# EAGLE design Adafruit Proto Shield v7-power (EAGLE 9.1.3)
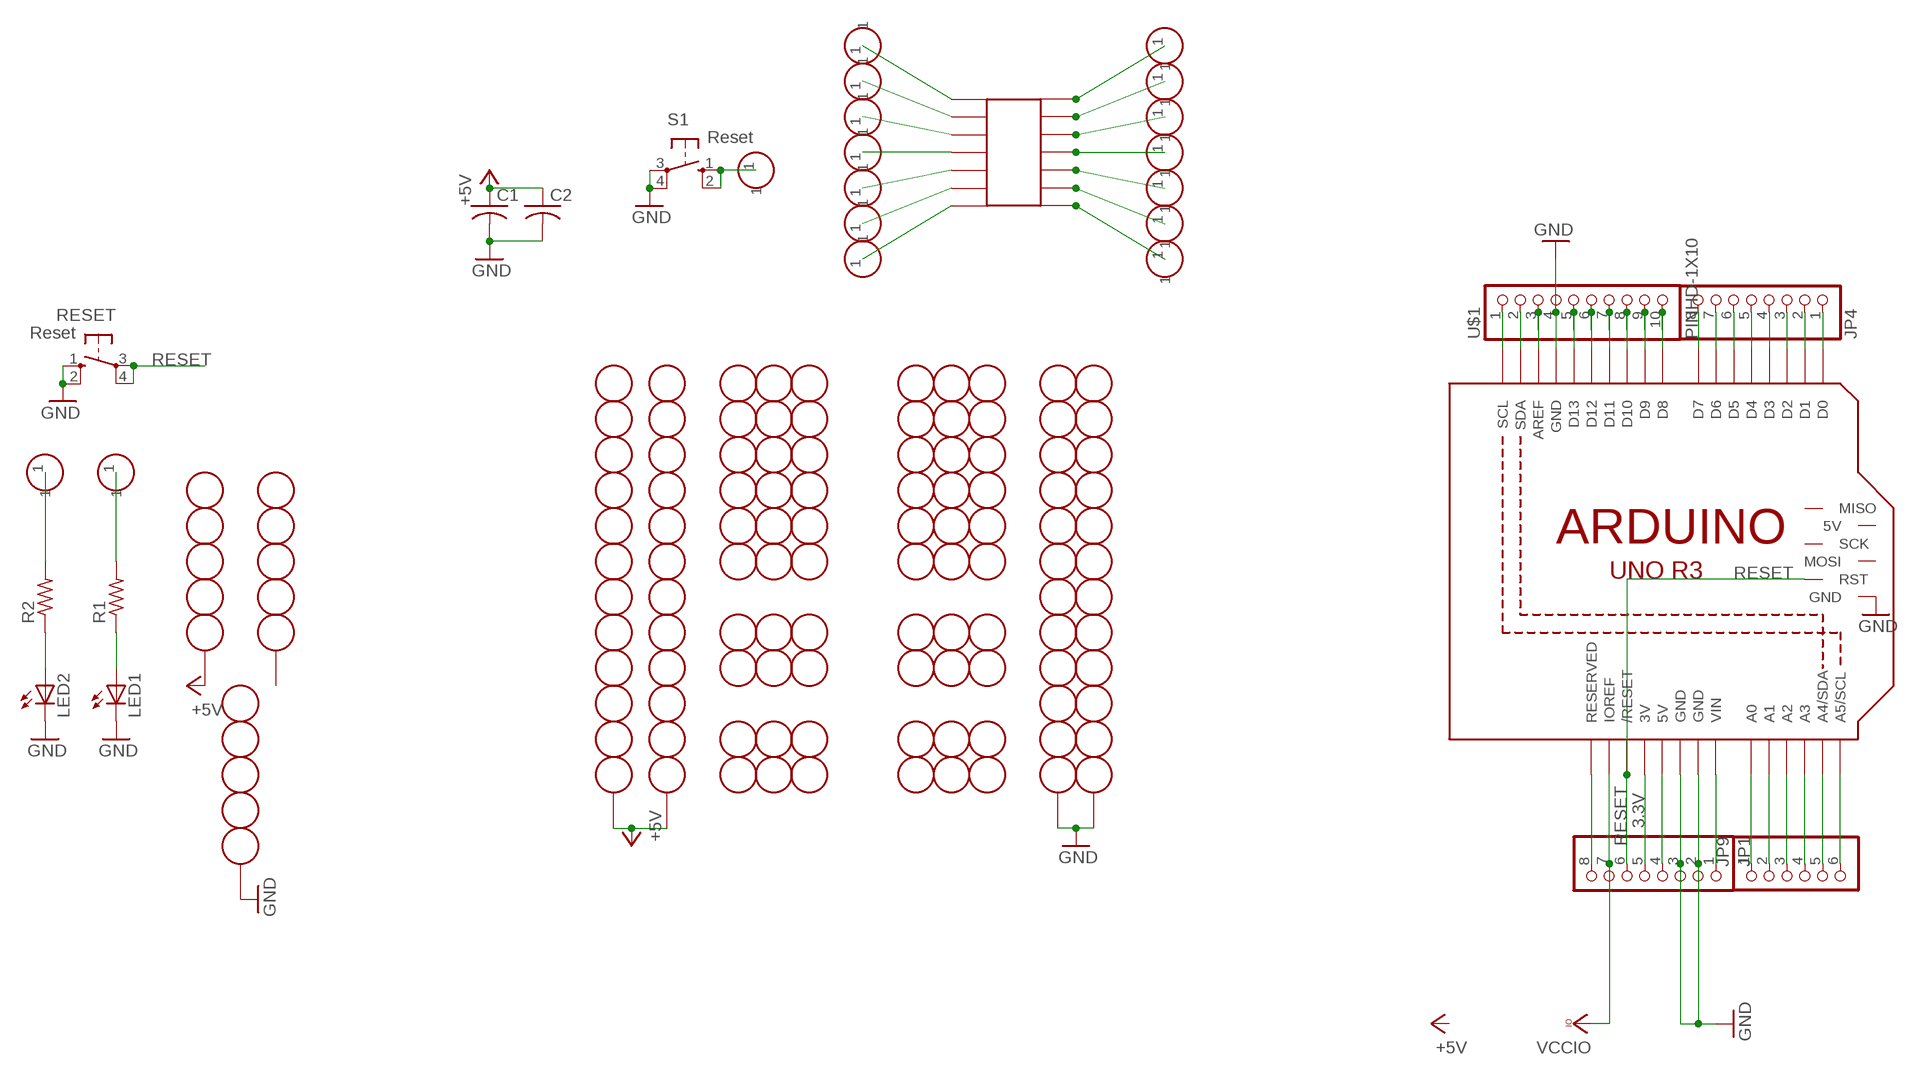
[diagram p0: schematic, sheet 1]

## Parts
C1  C-US025-025X050  [C025-025X050]
C2  C-US025-025X050  [C025-025X050]
GNDSTRIP1  12-STRIP  [12-STRIP]
GNDSTRIP2  12-STRIP  [12-STRIP]
IC1  SMD-14  [SO-14NMW]
JP1  PINHD-1X8BIG  [1X08-BIG]
JP4  PINHD-1X8BIG  [1X08-BIG]
JP9  PINHD-1X6B  [1X06-BIG]
LED1  LED3MM  [LED3MM]
LED2  LED3MM  [LED3MM]
M1  ARDUINO_R3_ICSP  [ARDUINOR3_ICSP]
R1  R-US_0207/5V  [0207/5V]
R2  R-US_0207/5V  [0207/5V]
RESET  Reset  10-XX  [B3F-10XX]
S1  Reset  10-XX  [B3F-10XX]
U$1  PINHD-1X10  [1X10-BIG]
U$2  PERFHOLE  [PERFHOLE]
U$3  5-STRIP  [5-STRIP]
U$4  PERFHOLE  [PERFHOLE]
U$5  3-STRIP  [3-STRIP]
U$6  PERFHOLE  [PERFHOLE]
U$7  PERFHOLE  [PERFHOLE]
U$8  PERFHOLE  [PERFHOLE]
U$9  PERFHOLE  [PERFHOLE]
U$10  3-STRIP  [3-STRIP]
U$11  3-STRIP  [3-STRIP]
U$12  3-STRIP  [3-STRIP]
U$13  3-STRIP  [3-STRIP]
U$14  3-STRIP  [3-STRIP]
U$15  3-STRIP  [3-STRIP]
U$16  PERFHOLE  [PERFHOLE]
U$17  3-STRIP  [3-STRIP]
U$18  3-STRIP  [3-STRIP]
U$19  PERFHOLE  [PERFHOLE]
U$20  3-STRIP  [3-STRIP]
U$21  3-STRIP  [3-STRIP]
U$22  3-STRIP  [3-STRIP]
U$23  3-STRIP  [3-STRIP]
U$24  5-STRIP  [5-STRIP]
U$25  PERFHOLE  [PERFHOLE]
U$26  3-STRIP  [3-STRIP]
U$27  PERFHOLE  [PERFHOLE]
U$28  3-STRIP  [3-STRIP]
U$29  3-STRIP  [3-STRIP]
U$30  3-STRIP  [3-STRIP]
U$31  3-STRIP  [3-STRIP]
U$32  3-STRIP  [3-STRIP]
U$33  3-STRIP  [3-STRIP]
U$34  PERFHOLE  [PERFHOLE]
U$35  PERFHOLE  [PERFHOLE]
U$37  PERFHOLE  [PERFHOLE]
U$38  PERFHOLE  [PERFHOLE]
U$39  PERFHOLE  [PERFHOLE]
U$40  PERFHOLE  [PERFHOLE]
U$41  PERFHOLE  [PERFHOLE]
U$43  5-STRIP  [5-STRIP]
VCCSTRIP1  12-STRIP  [12-STRIP]
VCCSTRIP2  12-STRIP  [12-STRIP]

## Nets
3.3V: JP1.5 M1.3V
+5V: C1.1 C2.1 JP1.4 M1.5V U$24.P$3 VCCSTRIP1.P$1 VCCSTRIP2.P$1
GND: C1.2 C2.2 GNDSTRIP1.P$1 GNDSTRIP2.P$1 JP1.2 JP1.3 LED1.K(C) LED2.K(C) M1.GND M1.GND@1(GND) M1.GND@2(GND) M1.GND@3(GND) RESET.1(S) RESET.2(S1) S1.3(P) S1.4(P1) U$1.4 U$43.P$3
N$2: M1.AREF U$1.3
N$4: JP1.8 M1.RESERVED
N$5: M1.D13 U$1.5
N$8: LED1.A R1.1
N$16: R1.2 U$7.1
N$40: R2.2 U$4.1
N$41: LED2.A R2.1
N$45: M1.D12 U$1.6
N$54: M1.D11 U$1.7
N$55: M1.D10 U$1.8
N$56: M1.D9 U$1.9
N$57: M1.D8 U$1.10
N$58: JP9.1 M1.A0
N$59: JP9.2 M1.A1
N$70: JP9.3 M1.A2
N$88: JP9.4 M1.A3
N$89: JP9.5 M1.A4(A4/SDA)
N$92: JP9.6 M1.A5(A5/SCL)
N$93: JP4.1 M1.D0
N$94: JP4.2 M1.D1
N$115: JP4.3 M1.D2
N$116: JP4.4 M1.D3
N$117: JP4.5 M1.D4
N$126: IC1.P$1 U$2.1
N$127: IC1.P$2 U$6.1
N$135: JP4.6 M1.D5
N$145: JP4.7 M1.D6
N$149: IC1.P$3 U$8.1
N$150: IC1.P$4 U$9.1
N$151: IC1.P$5 U$19.1
N$152: JP4.8 M1.D7
N$153: JP1.1 M1.VIN
N$154: M1.SCL U$1.1
N$155: IC1.P$6 U$25.1
N$156: IC1.P$7 U$27.1
N$157: IC1.P$8 U$34.1
N$158: IC1.P$9 U$35.1
N$159: IC1.P$10 U$37.1
N$164: M1.SDA U$1.2
N$165: IC1.P$11 U$38.1
N$166: IC1.P$12 U$39.1
N$167: IC1.P$13 U$40.1
N$178: IC1.P$14 U$41.1
N$194: S1.1(S) S1.2(S1) U$16.1
RESET: JP1.6 M1.RESET(/RESET) M1.RESET_ICSP(RST) RESET.3(P) RESET.4(P1)
VCCIO: JP1.7 M1.IOREF
Unconnected: M1.5V_ICSP(5V) M1.MISO M1.MOSI M1.SCK U$3.P$3

## Library data of the parts
C1 C2 = rcl-ez:C-US: CAPACITOR, American symbol
GNDSTRIP1 GNDSTRIP2 VCCSTRIP1 VCCSTRIP2 = Atmex:12-STRIP
IC1 = carduino:SMD-14
JP1 JP4 = carduino:PINHD-1X8: PIN HEADER
JP9 = carduino:PINHD-1X6: PIN HEADER
LED1 LED2 = adafruit:LED: LED OSRAM: - CHIPLED LG R971, LG N971, LY N971, LG Q971, LY Q971, LO R971, LY R971 LH N974, LH R974 LS Q976, LO Q976, LY Q976 LO Q996 - Hyper CHIPLED LW Q18S LB Q993, LB Q99A, LB R99A - SideLED LS A670, LO A670, LY A670, LG A670, LP A670 LB A673, LV A673, LT A673, LW A673 LH A674 LY A675 LS A676, LA A676, LO A676, LY A676, LW A676 LS A679, LY A679, LG A679 - Hyper Micro SIDELED® LS Y876, LA Y876, LO Y876, LY Y876 LT Y87S - SmartLED LW L88C, LW L88S LB L89C, LB L89S, LG L890 LS L89K, LO L89K, LY L89K LS L896, LA L896, LO L896, LY L896 - TOPLED LS T670, LO T670, LY T670, LG T670, LP T670 LSG T670, LSP T670, LSY T670, LOP T670, LYG T670 LG T671, LOG T671, LSG T671 LB T673, LV T673, LT T673, LW T673 LH T674 LS T676, LA T676, LO T676, LY T676, LB T676, LH T676, LSB T676, LW T676 LB T67C, LV T67C, LT T67C, LS T67K, LO T67K, LY T67K, LW E67C LS E67B, LA E67B, LO E67B, LY E67B, LB E67C, LV E67C, LT E67C LW T67C LS T679, LY T679, LG T679 LS T770, LO T770, LY T770, LG T770, LP T770 LB T773, LV T773, LT T773, LW T773 LH T774 LS E675, LA E675, LY E675, LS T675 LS T776, LA T776, LO T776, LY T776, LB T776 LHGB T686 LT T68C, LB T68C - Hyper Mini TOPLED® LB M676 - Mini TOPLED Santana® LG M470 LS M47K, LO M47K, LY M47K Source: http://www.osram.convergy.de/
M1 = adafruit:ARDUINO_R3_ICSP
R1 R2 = rcl-ez:R-US_: RESISTOR, American symbol
RESET S1 = switch-omron:10-XX: OMRON SWITCH
U$1 = adafruit:PINHD-1X10: Pin header 1x10 0.1" spacing With round pins
U$2 U$4 U$6-U$9 U$16 U$19 U$25 U$27 U$34 U$35 U$37-U$41 = Atmex:PERFHOLE
U$3 = protoshield:5-STRIP
U$5 U$10-U$15 U$17 U$18 U$20-U$23 U$26 U$28-U$33 = Atmex:3-STRIP
U$24 U$43 = Atmex:5-STRIP

## Board
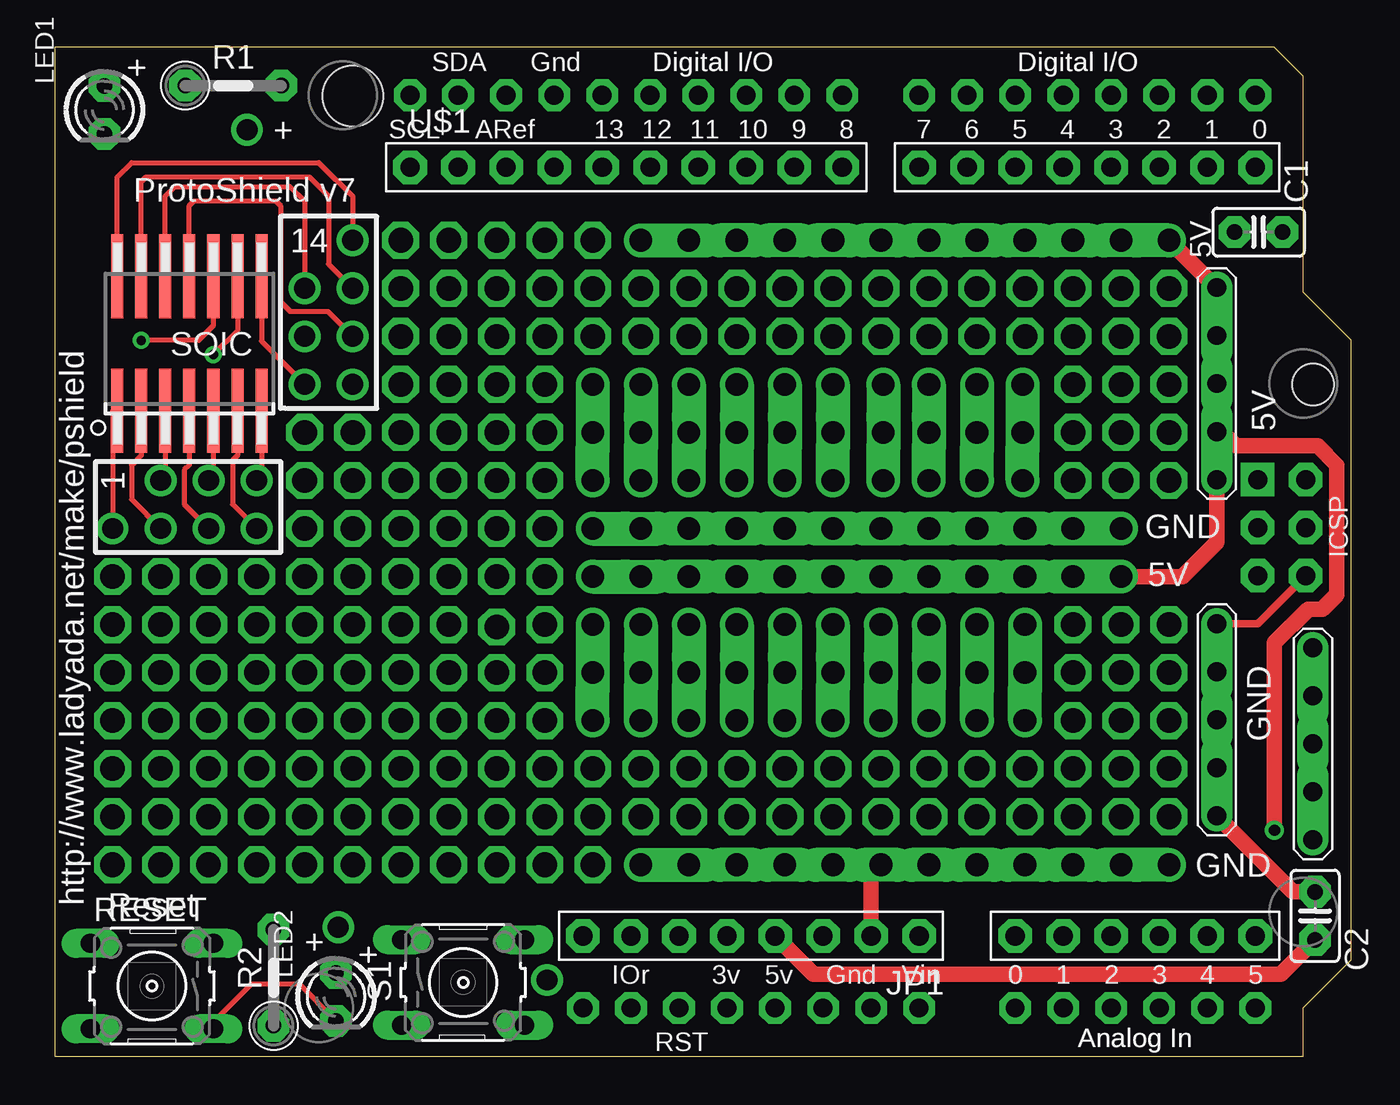
[diagram p1: board, top side]
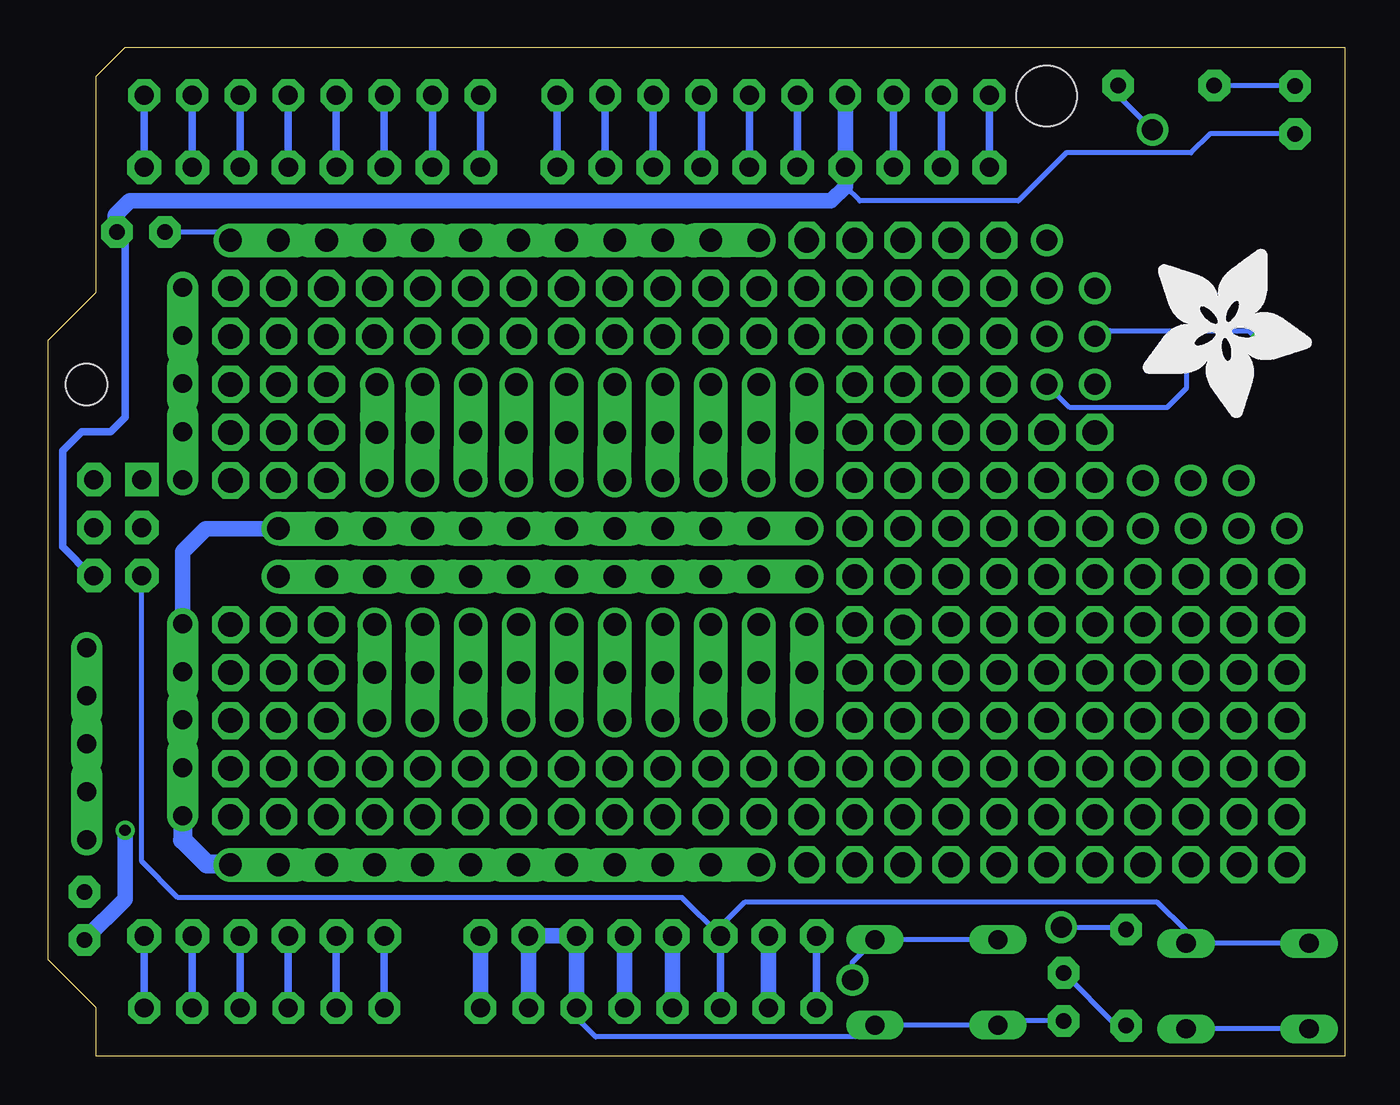
[diagram p2: board, bottom side, seen from below]

Size 68.58 x 53.34 mm. Coordinates in mm from the lower left corner, seen from the top.
Copper layers (1*16): Top 0.035mm / dielectric 1.5mm / Bottom 0.035mm
Design rules "adafruit": minimum track width 8mil, minimum drill 15.5mil, track to track 8mil, track to pad 8mil, pad to pad 8mil, via to via 8mil, smd to smd 8mil, copper to edge 10mil, drill to drill 8mil, minimum pad ring 10mil, minimum via ring 8mil, stop-mask expansion 2mil, vias tented up to drill 20mil, thermal gap 10mil
Holes 3.2 mm at 15.76,50.75
Holes 2.2 mm at 66.56,35.51

### Footprints (pad centres in the part's own frame; a part is rotated, then mirrored left to right if it is on the bottom)
C025-025X050 = drill 0.813 pad 1.676 octagon: 1 -1.27,0; 2 1.27,0
12-STRIP = drill 1.2 pad 1.676 offset: P$1 0,0; P$11 27.94,0 | drill 1.2 pad 1.676 long: P$2 2.54,0; P$3 5.08,0; P$4 7.62,0; P$5 10.16,0; P$6 12.7,0; P$7 15.24,0; P$8 17.78,0; P$9 20.32,0; P$10 22.86,0; P$12 25.4,0
SO-14NMW = smd 0.635 x 4.445: P$1 -3.048,-3.683; P$2 -1.778,-3.683; P$3 -0.508,-3.683; P$4 0.762,-3.683; P$5 2.032,-3.683; P$6 3.302,-3.683; P$7 4.572,-3.683; P$8 4.572,3.429; P$9 3.302,3.429; P$10 2.032,3.429; P$11 0.762,3.429; P$12 -0.508,3.429; P$13 -1.778,3.429; P$14 -3.048,3.429
1X08-BIG = drill 1.016 pad 1.778 octagon: 1 -8.89,0; 2 -6.35,0; 3 -3.81,0; 4 -1.27,0; 5 1.27,0; 6 3.81,0; 7 6.35,0; 8 8.89,0
1X06-BIG = drill 1.016 pad 1.778 octagon: 1 -6.35,0; 2 -3.81,0; 3 -1.27,0; 4 1.27,0; 5 3.81,0; 6 6.35,0
LED3MM = drill 0.813 pad 1.676 octagon: A -1.27,0; K 1.27,0
ARDUINOR3_ICSP = drill 1 pad 1.676 octagon: 3V 35.56,2.54; 5V 38.1,2.54; A0 50.8,2.54; A1 53.34,2.54; A2 55.88,2.54; A3 58.42,2.54; A4 60.96,2.54; A5 63.5,2.54; AREF 23.876,50.8; D0 63.5,50.8; D1 60.96,50.8; D2 58.42,50.8; D3 55.88,50.8; D4 53.34,50.8; D5 50.8,50.8; D6 48.26,50.8; D7 45.72,50.8; D8 41.656,50.8; D9 39.116,50.8; D10 36.576,50.8; D11 34.036,50.8; D12 31.496,50.8; D13 28.956,50.8; GND 26.416,50.8; GND@1 43.18,2.54; GND@2 40.64,2.54; IOREF 30.48,2.54; RESERVED 27.94,2.54; RESET 33.02,2.54; SCL 18.796,50.8; SDA 21.336,50.8; VIN 45.72,2.54 | drill 1 pad 1.778 octagon: 5V_ICSP 66.167,30.48; GND@3 66.167,25.4; MOSI 66.167,27.94; RESET_ICSP 63.627,25.4; SCK 63.627,27.94 | drill 1 pad 1.778 square: MISO 63.627,30.48
0207/5V = drill 0.813 pad 1.676 octagon: 1 -2.54,0; 2 2.54,0
B3F-10XX = drill 1.016 long: 1 -3.251,2.261; 2 3.251,2.261; 3 -3.251,-2.261; 4 3.251,-2.261
1X10-BIG = drill 1.016 pad 1.778 octagon: 1 -11.43,0; 2 -8.89,0; 3 -6.35,0; 4 -3.81,0; 5 -1.27,0; 6 1.27,0; 7 3.81,0; 8 6.35,0; 9 8.89,0; 10 11.43,0
PERFHOLE = drill 1.1 pad 1.676: 1 0,0
5-STRIP = drill 1 pad 1.676 long: P$1 2.54,0; P$2 5.08,0; P$5 7.62,0 | drill 1 pad 1.676 offset: P$3 0,0; P$4 10.16,0
3-STRIP = drill 1.2 pad 1.676 offset: 1 -2.54,0; P$5 2.54,0 | drill 1.2 pad 1.676 long: P$6 0,0

### Placement (x,y rotation side)
C1  63.67,43.57 0 top
C2  66.66,7.41 90 top
GNDSTRIP1  56.4,27.89 180 top
GNDSTRIP2  58.94,10.11 180 top
IC1  6.36,37.8 0 top
JP1  36.83,6.35 180 top
JP4  54.61,46.99 180 top
JP9  57.15,6.35 0 top
LED1  2.62,50.03 270 top
LED2  14.87,3.13 270 top
M1  0,0 0 top
R1  9.44,51.32 0 top
R2  11.57,4.15 90 top
RESET  5.14,3.7 180 top
S1  21.6,3.89 0 top
U$1  30.23,46.99 0 top
U$2  3.06,27.89 0 top
U$3  66.55,11.43 90 top
U$4  15,6.81 0 top
U$5  48.78,20.27 90 top
U$6  5.6,27.89 0 top
U$7  10.17,48.98 0 top
U$8  5.6,30.43 0 top
U$9  8.14,27.89 0 top
U$10  46.24,32.97 90 top
U$11  46.24,20.27 90 top
U$12  48.78,32.97 90 top
U$13  51.19,32.97 90 top
U$14  51.32,20.27 90 top
U$15  43.83,32.97 90 top
U$16  26.05,4.02 0 top
U$17  28.46,32.97 90 top
U$18  31,20.27 90 top
U$19  8.14,30.43 0 top
U$20  33.54,32.97 90 top
U$21  38.62,32.97 90 top
U$22  36.08,20.27 90 top
U$23  38.62,20.27 90 top
U$24  61.47,30.48 90 top
U$25  10.68,27.89 0 top
U$26  28.46,20.27 90 top
U$27  10.68,30.43 0 top
U$28  41.16,32.97 90 top
U$29  31,32.97 90 top
U$30  36.08,32.97 90 top
U$31  33.54,20.27 90 top
U$32  43.7,20.27 90 top
U$33  41.16,20.27 90 top
U$34  13.22,35.51 90 top
U$35  15.76,35.51 90 top
U$36  [ADAFRUIT_9MM]  10.67,42.67 270 bottom
U$37  13.22,38.05 90 top
U$38  15.76,38.05 90 top
U$39  13.22,40.59 90 top
U$40  15.76,40.59 90 top
U$41  15.76,43.13 90 top
U$43  61.47,12.7 90 top
VCCSTRIP1  58.94,43.13 180 top
VCCSTRIP2  56.4,25.35 180 top

### Tracks (layer width: path | path; a pad name or v marks a point on that pad's centre or on a via)
3.3V
  Bottom 0.813: JP1.5 M1.3V
+5V  (via drill 0.6)
  Top 0.813: VCCSTRIP2.P$1 59.64,25.35 61.47,27.18 U$24.P$3 61.47,33.27 | VCCSTRIP1.P$1 61.47,40.6 61.47,33.27 | JP1.4 40.13,4.32 64.84,4.32 C2.1 | 61.47,33.27 62.48,32.26 66.8,32.26 67.82,31.24 67.82,24.38 67.06,23.62 66.29,23.62 64.52,21.84 v64.52,11.94
  Bottom 0.254: VCCSTRIP1.P$1 59.38,43.57 C1.1
  Bottom 0.406: 61.47,30.73 U$24.P$3
  Bottom 0.813: JP1.4 M1.5V | v64.52,11.94 64.52,8.29 C2.1
GND
  Top 0.254: RESET.1 8.39,1.79 10.41,3.81 12.92,3.81 LED2.K
  Top 0.406: M1.GND@3 63.63,22.86 61.98,22.86 61.47,22.35 U$43.P$3
  Top 0.813: JP1.2 43.18,9.91 43.39,10.11 GNDSTRIP2.P$1 | C2.2 65.49,8.68 U$43.P$3
  Bottom 0.254: LED2.K 18.12,1.86 S1.3 S1.4 25.47,1.02 39.62,1.02 40.64,2.03 M1.GND@2 | RESET.2 RESET.1 | LED1.K 7.12,48.76 8.13,47.75 14.73,47.75 17.27,45.21 25.65,45.21 26.42,45.97
  Bottom 0.406: C1.2 64.52,43.14 64.52,33.78 65.28,33.02 66.8,33.02 67.82,32 67.82,26.92 66.29,25.4 M1.GND@3
  Bottom 0.813: M1.GND U$1.4 26.42,45.97 27.18,45.21 64.26,45.21 65.02,44.45 65.02,43.65 C1.2 | M1.GND@2 JP1.3 JP1.2 M1.GND@1 | GNDSTRIP1.P$1 60.24,27.89 61.47,26.67 U$43.P$3
  Bottom 1.016: U$43.P$3 61.47,11.43 60.2,10.16 58.98,10.16 GNDSTRIP2.P$1
N$1  (via drill 1.3 pad 1.93)
  other vias: 58.94,30.43
N$2
  Bottom 0.406: U$1.3 M1.AREF
N$3  (via drill 1.3 pad 1.93)
  other vias: 13.22,32.97
N$4
  Bottom 0.406: JP1.8 M1.RESERVED
N$5
  Bottom 0.406: M1.D13 U$1.5
N$6  (via drill 1.3 pad 1.93)
  other vias: 13.22,30.43
N$7  (via drill 1.3 pad 1.93)
  other vias: 13.22,27.89
N$8
  Bottom 0.254: LED1.A 6.88,51.3 R1.1
N$9  (via drill 1.3 pad 1.93)
  other vias: 3.06,25.35
N$10  (via drill 1.3 pad 1.93)
  other vias: 3.06,22.81
N$11  (via drill 1.3 pad 1.93)
  other vias: 36.08,12.65
N$12  (via drill 1.3 pad 1.93)
  other vias: 36.08,15.19
N$13  (via drill 1.3 pad 1.93)
  other vias: 36.08,38.05
N$14  (via drill 1.3 pad 1.93)
  other vias: 36.08,40.59
N$16
  Bottom 0.254: R1.2 11.98,50.79 U$7.1
N$17  (via drill 1.3 pad 1.93)
  other vias: 8.14,25.35
N$18  (via drill 1.3 pad 1.93)
  other vias: 8.14,22.81
N$19  (via drill 1.3 pad 1.93)
  other vias: 8.14,20.27
N$20  (via drill 1.3 pad 1.93)
  other vias: 25.92,10.11
N$21  (via drill 1.3 pad 1.93)
  other vias: 23.38,10.11
N$22  (via drill 1.3 pad 1.93)
  other vias: 28.46,10.11
N$23  (via drill 1.3 pad 1.93)
  other vias: 8.14,10.11
N$24  (via drill 1.3 pad 1.93)
  other vias: 10.68,10.11
N$25  (via drill 1.3 pad 1.93)
  other vias: 23.38,30.43
N$26  (via drill 1.3 pad 1.93)
  other vias: 23.38,32.97
N$27  (via drill 1.3 pad 1.93)
  other vias: 23.38,35.51
N$28  (via drill 1.3 pad 1.93)
  other vias: 25.92,30.43
N$29  (via drill 1.3 pad 1.93)
  other vias: 25.92,32.97
N$30  (via drill 1.3 pad 1.93)
  other vias: 33.54,12.65
N$31  (via drill 1.3 pad 1.93)
  other vias: 33.54,15.19
N$32  (via drill 1.3 pad 1.93)
  other vias: 33.54,38.05
N$33  (via drill 1.3 pad 1.93)
  other vias: 33.54,40.59
N$34  (via drill 1.3 pad 1.93)
  other vias: 18.3,10.11
N$35  (via drill 1.3 pad 1.93)
  other vias: 25.92,35.51
N$36  (via drill 1.3 pad 1.93)
  other vias: 23.38,17.73
N$37  (via drill 1.3 pad 1.93)
  other vias: 23.38,20.27
N$38  (via drill 1.3 pad 1.93)
  other vias: 10.68,22.81
N$39  (via drill 1.3 pad 1.93)
  other vias: 10.68,25.35
N$40
  Bottom 0.254: U$4.1 11.69,6.81 R2.2
N$41
  Bottom 0.254: R2.1 12.07,1.6 LED2.A
N$42  (via drill 1.3 pad 1.93)
  other vias: 3.06,20.27
N$43  (via drill 1.3 pad 1.93)
  other vias: 5.6,22.81
N$44  (via drill 1.3 pad 1.93)
  other vias: 5.6,25.35
N$45
  Bottom 0.406: U$1.6 M1.D12
N$46  (via drill 1.3 pad 1.93)
  other vias: 38.62,12.65
N$47  (via drill 1.3 pad 1.93)
  other vias: 38.62,15.19
N$48  (via drill 1.3 pad 1.93)
  other vias: 10.68,20.27
N$49  (via drill 1.3 pad 1.93)
  other vias: 20.84,10.11
N$50  (via drill 1.3 pad 1.93)
  other vias: 13.22,10.11
N$51  (via drill 1.3 pad 1.93)
  other vias: 13.22,20.27
N$52  (via drill 1.3 pad 1.93)
  other vias: 13.22,22.81
N$53  (via drill 1.3 pad 1.93)
  other vias: 13.22,25.35
N$54
  Bottom 0.406: M1.D11 U$1.7
N$55
  Bottom 0.406: U$1.8 M1.D10
N$56
  Bottom 0.406: M1.D9 U$1.9
N$57
  Bottom 0.406: U$1.10 M1.D8
N$58
  Bottom 0.406: JP9.1 M1.A0
N$59
  Bottom 0.406: M1.A1 JP9.2
N$60  (via drill 1.3 pad 1.93)
  other vias: 41.16,12.65
N$61  (via drill 1.3 pad 1.93)
  other vias: 15.76,10.11
N$62  (via drill 1.3 pad 1.93)
  other vias: 25.92,43.13
N$63  (via drill 1.3 pad 1.93)
  other vias: 23.38,43.13
N$64  (via drill 1.3 pad 1.93)
  other vias: 41.16,15.19
N$65  (via drill 1.3 pad 1.93)
  other vias: 41.16,38.05
N$66  (via drill 1.3 pad 1.93)
  other vias: 41.16,40.59
N$67  (via drill 1.3 pad 1.93)
  other vias: 28.46,43.13
N$68  (via drill 1.3 pad 1.93)
  other vias: 38.62,38.05
N$69  (via drill 1.3 pad 1.93)
  other vias: 38.62,40.59
N$70
  Bottom 0.406: JP9.3 M1.A2
N$71  (via drill 1.3 pad 1.93)
  other vias: 18.3,30.43
N$72  (via drill 1.3 pad 1.93)
  other vias: 18.3,32.97
N$73  (via drill 1.3 pad 1.93)
  other vias: 18.3,35.51
N$74  (via drill 1.3 pad 1.93)
  other vias: 18.3,38.05
N$75  (via drill 1.3 pad 1.93)
  other vias: 18.3,40.59
N$76  (via drill 1.3 pad 1.93)
  other vias: 46.24,12.65
N$77  (via drill 1.3 pad 1.93)
  other vias: 46.24,15.19
N$78  (via drill 1.3 pad 1.93)
  other vias: 46.24,38.05
N$79  (via drill 1.3 pad 1.93)
  other vias: 46.24,40.59
N$80  (via drill 1.3 pad 1.93)
  other vias: 5.6,20.27
N$81  (via drill 1.3 pad 1.93)
  other vias: 18.3,27.89
N$82  (via drill 1.3 pad 1.93)
  other vias: 18.3,25.35
N$83  (via drill 1.3 pad 1.93)
  other vias: 18.3,22.81
N$84  (via drill 1.3 pad 1.93)
  other vias: 18.3,20.27
N$85  (via drill 1.3 pad 1.93)
  other vias: 18.3,43.13
N$86  (via drill 1.3 pad 1.93)
  other vias: 20.84,43.13
N$87  (via drill 1.3 pad 1.93)
  other vias: 23.38,22.69
N$88
  Bottom 0.406: M1.A3 JP9.4
N$89
  Bottom 0.406: JP9.5 M1.A4
N$90  (via drill 1.3 pad 1.93)
  other vias: 15.76,30.43
N$91  (via drill 1.3 pad 1.93)
  other vias: 15.76,32.97
N$92
  Bottom 0.406: M1.A5 JP9.6
N$93
  Bottom 0.406: M1.D0 JP4.1
N$94
  Bottom 0.406: M1.D1 JP4.2
N$95  (via drill 1.3 pad 1.93)
  other vias: 43.7,12.65
N$96  (via drill 1.3 pad 1.93)
  other vias: 43.7,15.19
N$97  (via drill 1.3 pad 1.93)
  other vias: 43.7,38.05
N$98  (via drill 1.3 pad 1.93)
  other vias: 43.7,40.59
N$99  (via drill 1.3 pad 1.93)
  other vias: 15.76,20.27
N$100  (via drill 1.3 pad 1.93)
  other vias: 15.76,27.89
N$101  (via drill 1.3 pad 1.93)
  other vias: 15.76,25.35
N$102  (via drill 1.3 pad 1.93)
  other vias: 15.76,22.81
N$103  (via drill 1.3 pad 1.93)
  other vias: 20.84,22.81
N$104  (via drill 1.3 pad 1.93)
  other vias: 20.84,25.35
N$105  (via drill 1.3 pad 1.93)
  other vias: 20.84,27.89
N$106  (via drill 1.3 pad 1.93)
  other vias: 20.84,30.43
N$107  (via drill 1.3 pad 1.93)
  other vias: 20.84,32.97
N$108  (via drill 1.3 pad 1.93)
  other vias: 20.84,35.51
N$109  (via drill 1.3 pad 1.93)
  other vias: 20.84,38.05
N$110  (via drill 1.3 pad 1.93)
  other vias: 20.84,40.59
N$111  (via drill 1.3 pad 1.93)
  other vias: 48.78,12.65
N$112  (via drill 1.3 pad 1.93)
  other vias: 48.78,15.19
N$113  (via drill 1.3 pad 1.93)
  other vias: 20.84,20.27
N$114  (via drill 1.3 pad 1.93)
  other vias: 3.06,17.73
N$115
  Bottom 0.406: M1.D2 JP4.3
N$116
  Bottom 0.406: M1.D3 JP4.4
N$117
  Bottom 0.406: M1.D4 JP4.5
N$118  (via drill 1.3 pad 1.93)
  other vias: 3.06,15.19
N$119  (via drill 1.3 pad 1.93)
  other vias: 3.06,12.65
N$120  (via drill 1.3 pad 1.93)
  other vias: 5.6,15.19
N$121  (via drill 1.3 pad 1.93)
  other vias: 5.6,17.73
N$122  (via drill 1.3 pad 1.93)
  other vias: 5.6,12.65
N$123  (via drill 1.3 pad 1.93)
  other vias: 3.06,10.11
N$124  (via drill 1.3 pad 1.93)
  other vias: 5.6,10.11
N$125  (via drill 1.3 pad 1.93)
  other vias: 51.32,12.65
N$126
  Top 0.254: IC1.P$1 3.06,34.12 U$2.1
N$127
  Top 0.254: IC1.P$2 4.58,31.76 4.06,31.24 4.06,29.43 U$6.1
N$128  (via drill 1.3 pad 1.93)
  other vias: 58.94,32.97
N$129  (via drill 1.3 pad 1.93)
  other vias: 51.32,15.19
N$130  (via drill 1.3 pad 1.93)
  other vias: 51.32,38.05
N$131  (via drill 1.3 pad 1.93)
  other vias: 51.32,40.59
N$132  (via drill 1.3 pad 1.93)
  other vias: 58.94,35.51
N$133  (via drill 1.3 pad 1.93)
  other vias: 48.78,38.05
N$134  (via drill 1.3 pad 1.93)
  other vias: 48.78,40.59
N$135
  Bottom 0.406: M1.D5 JP4.6
N$136  (via drill 1.3 pad 1.93)
  other vias: 58.94,17.73
N$137  (via drill 1.3 pad 1.93)
  other vias: 58.94,20.27
N$138  (via drill 1.3 pad 1.93)
  other vias: 53.86,30.43
N$139  (via drill 1.3 pad 1.93)
  other vias: 53.86,32.97
N$140  (via drill 1.3 pad 1.93)
  other vias: 53.86,35.51
N$141  (via drill 1.3 pad 1.93)
  other vias: 56.4,12.65
N$142  (via drill 1.3 pad 1.93)
  other vias: 56.4,15.19
N$143  (via drill 1.3 pad 1.93)
  other vias: 56.4,38.05
N$144  (via drill 1.3 pad 1.93)
  other vias: 56.4,40.59
N$145
  Bottom 0.406: JP4.7 M1.D6
N$146  (via drill 1.3 pad 1.93)
  other vias: 53.86,22.81
N$147  (via drill 1.3 pad 1.93)
  other vias: 53.86,20.27
N$148  (via drill 1.3 pad 1.93)
  other vias: 53.86,17.73
N$149
  Top 0.254: IC1.P$3 5.85,30.69 U$8.1
N$150
  Top 0.254: IC1.P$4 7.12,31.25 6.86,30.99 6.86,29.17 U$9.1
N$151
  Top 0.254: IC1.P$5 8.39,30.69 U$19.1
N$152
  Bottom 0.406: M1.D7 JP4.8
N$153
  Bottom 0.813: M1.VIN JP1.1
N$154
  Bottom 0.406: M1.SCL U$1.1
N$155
  Top 0.254: IC1.P$6 9.66,31.76 9.4,31.5 9.4,29.17 U$25.1
N$156
  Top 0.254: IC1.P$7 10.93,30.69 U$27.1
N$157
  Top 0.254: IC1.P$8 10.93,37.8 U$34.1
N$158  (via drill 0.5)
  Top 0.254: IC1.P$9 9.66,38.36 v8.38,37.08
  Bottom 0.254: v8.38,37.08 8.38,35.31 9.4,34.29 14.53,34.29 U$35.1
N$159  (via drill 0.5)
  Top 0.254: IC1.P$10 8.39,38.62 7.62,37.85 v4.57,37.85
  Bottom 0.254: U$37.1 13.01,37.85 12.45,38.35 5.08,38.35 v4.57,37.85
N$160  (via drill 1.3 pad 1.93)
  other vias: 53.86,12.65
N$161  (via drill 1.3 pad 1.93)
  other vias: 53.86,15.19
N$162  (via drill 1.3 pad 1.93)
  other vias: 53.86,38.05
N$163  (via drill 1.3 pad 1.93)
  other vias: 53.86,40.59
N$164
  Bottom 0.406: M1.SDA U$1.2
N$165
  Top 0.254: IC1.P$11 7.12,44.97 7.37,45.21 11.68,45.21 11.94,44.96 11.94,39.88 12.45,39.37 14.44,39.37 U$38.1
N$166
  Top 0.254: IC1.P$12 5.85,45.48 6.35,45.97 12.45,45.97 13.21,45.21 13.21,40.6 U$39.1
N$167
  Top 0.254: IC1.P$13 4.58,46.24 4.83,46.48 13.46,46.48 14.48,45.47 14.48,41.87 U$40.1
N$168  (via drill 1.3 pad 1.93)
  other vias: 56.4,17.73
N$169  (via drill 1.3 pad 1.93)
  other vias: 56.4,20.27
N$170  (via drill 1.3 pad 1.93)
  other vias: 56.4,22.81
N$171  (via drill 1.3 pad 1.93)
  other vias: 58.94,22.81
N$172  (via drill 1.3 pad 1.93)
  other vias: 25.92,27.89
N$173  (via drill 1.3 pad 1.93)
  other vias: 56.4,30.43
N$174  (via drill 1.3 pad 1.93)
  other vias: 56.4,32.97
N$175  (via drill 1.3 pad 1.93)
  other vias: 56.4,35.51
N$176  (via drill 1.3 pad 1.93)
  other vias: 58.94,12.65
N$177  (via drill 1.3 pad 1.93)
  other vias: 58.94,15.19
N$178
  Top 0.254: IC1.P$14 3.31,46.49 4.06,47.24 13.97,47.24 15.76,45.46 U$41.1
N$193  (via drill 1.3 pad 1.93)
  other vias: 25.92,25.35
N$194
  Bottom 0.254: U$16.1 26.05,4.96 S1.2 S1.1
N$195  (via drill 1.3 pad 1.93)
  other vias: 23.38,27.89
N$196  (via drill 1.3 pad 1.93)
  other vias: 23.38,25.35
N$198  (via drill 1.3 pad 1.93)
  other vias: 58.94,38.05
N$199  (via drill 1.3 pad 1.93)
  other vias: 58.94,40.59
N$206  (via drill 1.3 pad 1.93)
  other vias: 25.92,12.65
N$207  (via drill 1.3 pad 1.93)
  other vias: 25.92,15.19
N$208  (via drill 1.3 pad 1.93)
  other vias: 25.92,38.05
N$209  (via drill 1.3 pad 1.93)
  other vias: 25.92,40.59
N$210  (via drill 1.3 pad 1.93)
  other vias: 8.14,17.73
N$214  (via drill 1.3 pad 1.93)
  other vias: 8.14,15.19
N$215  (via drill 1.3 pad 1.93)
  other vias: 8.14,12.65
N$216  (via drill 1.3 pad 1.93)
  other vias: 25.92,17.73
N$217  (via drill 1.3 pad 1.93)
  other vias: 25.92,20.27
N$218  (via drill 1.3 pad 1.93)
  other vias: 10.68,15.19
N$219  (via drill 1.3 pad 1.93)
  other vias: 10.68,17.73
N$225  (via drill 1.3 pad 1.93)
  other vias: 23.38,12.65
N$226  (via drill 1.3 pad 1.93)
  other vias: 23.38,15.19
N$227  (via drill 1.3 pad 1.93)
  other vias: 23.38,38.05
N$228  (via drill 1.3 pad 1.93)
  other vias: 23.38,40.59
N$229  (via drill 1.3 pad 1.93)
  other vias: 10.68,12.65
N$241  (via drill 1.3 pad 1.93)
  other vias: 28.46,12.65
N$242  (via drill 1.3 pad 1.93)
  other vias: 28.46,15.19
N$255  (via drill 1.3 pad 1.93)
  other vias: 31,12.65
N$258  (via drill 1.3 pad 1.93)
  other vias: 13.22,15.19
N$259  (via drill 1.3 pad 1.93)
  other vias: 31,15.19
N$260  (via drill 1.3 pad 1.93)
  other vias: 31,38.05
N$261  (via drill 1.3 pad 1.93)
  other vias: 31,40.59
N$262  (via drill 1.3 pad 1.93)
  other vias: 13.22,17.73
N$263  (via drill 1.3 pad 1.93)
  other vias: 28.46,38.05
N$264  (via drill 1.3 pad 1.93)
  other vias: 28.46,40.59
N$265  (via drill 1.3 pad 1.93)
  other vias: 18.3,17.73
N$266  (via drill 1.3 pad 1.93)
  other vias: 18.3,15.19
N$267  (via drill 1.3 pad 1.93)
  other vias: 18.3,12.65
N$268  (via drill 1.3 pad 1.93)
  other vias: 15.76,17.73
N$269  (via drill 1.3 pad 1.93)
  other vias: 15.76,15.19
N$270  (via drill 1.3 pad 1.93)
  other vias: 20.84,15.19
N$271  (via drill 1.3 pad 1.93)
  other vias: 20.84,17.73
N$272  (via drill 1.3 pad 1.93)
  other vias: 20.84,12.65
N$273  (via drill 1.3 pad 1.93)
  other vias: 25.92,22.81
N$274  (via drill 1.3 pad 1.93)
  other vias: 13.22,12.65
N$275  (via drill 1.3 pad 1.93)
  other vias: 15.76,12.65
RESET
  Bottom 0.254: RESET.4 RESET.3 8.39,6.61 9.91,8.13 31.75,8.13 33.02,6.86 JP1.6 35.05,8.38 61.72,8.38 63.63,10.29 M1.RESET_ICSP
  Bottom 0.406: JP1.6 M1.RESET
VCCIO
  Bottom 0.813: M1.IOREF JP1.7

### Text on the board
tPlace: Digital I/O | Digital I/O | + | ProtoShield v7 | 5V | 14 | SOIC | 5V | 1 | GND | ICSP | 5V | GND | GND | http://www.ladyada.net/make/pshield | Reset | + | Analog In